# Altium schematic sheet 08-AD9513-1.SchDoc
size A; SheetNumber: 8; SheetTotal: 16
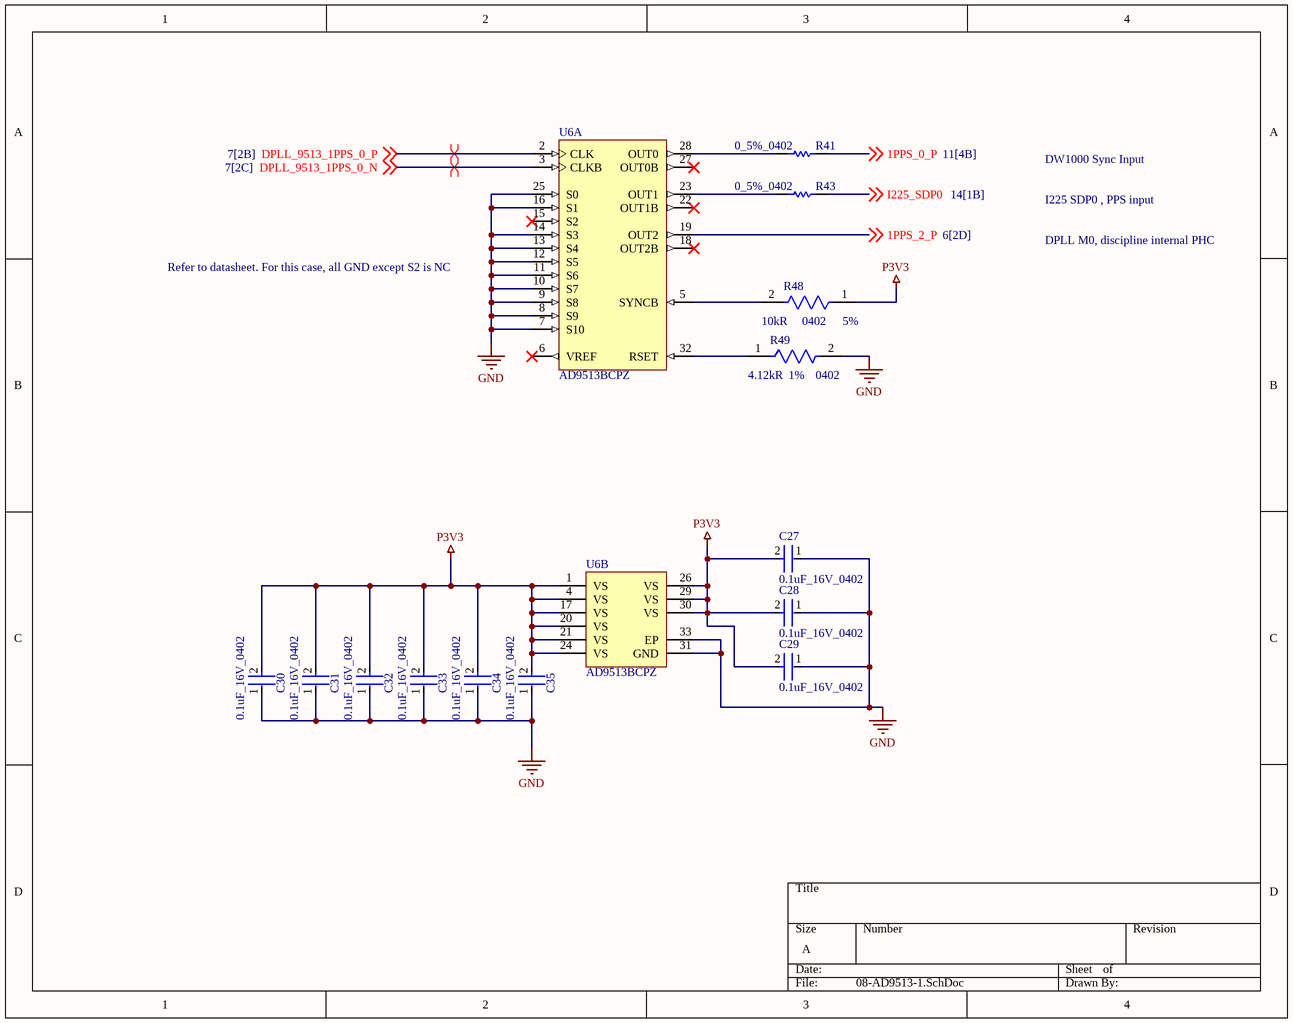
[diagram p0: 08-AD9513-1.SchDoc]

## Parts
C27  0.1uF_16V_0402  [FP-GRM15-MFG]
C28  0.1uF_16V_0402  [FP-GRM15-MFG]
C29  0.1uF_16V_0402  [FP-GRM15-MFG]
C30  0.1uF_16V_0402  [FP-GRM15-MFG]
C31  0.1uF_16V_0402  [FP-GRM15-MFG]
C32  0.1uF_16V_0402  [FP-GRM15-MFG]
C33  0.1uF_16V_0402  [FP-GRM15-MFG]
C34  0.1uF_16V_0402  [FP-GRM15-MFG]
C35  0.1uF_16V_0402  [FP-GRM15-MFG]
R41  0_5%_0402  [RESC1005X40X25LL10T10]
R43  0_5%_0402  [RESC1005X40X25LL10T10]
R48  Case/Package: 0402  Resistance: 10kR  Tolerance: 5%  [FP-CRCW0402-e3-IPC_B]  (hidden comment: CRCW040210K0JNED)
R49  Resistance: 4.12kR  Case/Package: 0402  Tolerance: 1%  [FP-CRCW0402-e3-IPC_A]  (hidden comment: CRCW04024K12FKED)
U6  AD9513BCPZ  [ADI-CP-32-2_N]  (parts A,B of 2)

## Nets
GND: C27.1 C28.1 C29.1 C30.1 C31.1 C32.1 C33.1 C34.1 C35.1 R49.2 U6.7(S10) U6.8(S9) U6.9(S8) U6.10(S7) U6.11(S6) U6.12(S5) U6.13(S4) U6.14(S3) U6.16(S1) U6.25(S0) U6.31(GND) U6.33(EP)
P3V3: C27.2 C28.2 C29.2 C30.2 C31.2 C32.2 C33.2 C34.2 C35.2 R48.1 U6.1(VS) U6.4(VS) U6.17(VS) U6.20(VS) U6.21(VS) U6.24(VS) U6.26(VS) U6.29(VS) U6.30(VS)
1PPS_0_P: R41.2 ; off-sheet 1PPS_0_P
1PPS_2_P: U6.19(OUT2) ; off-sheet 1PPS_2_P
DPLL_9513_1PPS_0_N: U6.3(CLKB) ; off-sheet DPLL_9513_1PPS_0_N
DPLL_9513_1PPS_0_P: U6.2(CLK) ; off-sheet DPLL_9513_1PPS_0_P
I225_SDP0: R43.2 ; off-sheet I225_SDP0
NetR41_1: R41.1 U6.28(OUT0)
NetR43_1: R43.1 U6.23(OUT1)
NetR48_2: R48.2 U6.5(SYNCB)
NetR49_1: R49.1 U6.32(RSET)

Not connected (* = marked no-connect by the designer): U6 6(VREF)* 15(S2)* 18(OUT2B)* 22(OUT1B)* 27(OUT0B)*

## Layout directives
differential pair; differential pair class 100ohm: DPLL_9513_1PPS_0_N, DPLL_9513_1PPS_0_P

## Notes on the sheet
- DW1000 Sync Input
- I225 SDP0 , PPS input
- (near U6) Refer to datasheet. For this case, all GND except S2 is NC
- DPLL M0, discipline internal PHC

## Library data of the parts
C27-C35 = CMP-2100-03641-2: CAP CER 0.1UF 16V X7R 0402; Manufacturer Part Number: GRM155R71C104KA88D; Manufacturer: Murata; Standoff Height: 0mm; Tolerance: 10%; Voltage Rating: 16Vdc; Material: Ceramic; Capacitance: 0.10μF; Value: 0.10μF; RoHS: TRUE; Temperature Characteristic: X7R; Octopart: https://octopart.com/grm155r71c104ka88d-murata-196880; Digikey Description: CAP CER 0.1UF 16V X7R 0402; Device Class L3: Ceramic Capacitors; Height: 0.55mm; ComponentLink2Description: Datasheet; Temperature Range Low: -55°C; Ipc Land Pattern Name: CAPC10050X219; ComponentLink2URL: https://search.murata.co.jp/Ceramy/image/img/A01X/G101/ENG/GRM155R71H471KA01-01A.pdf; Device Class L1: Passive Components; Lead Free: yes; Category: Cap; Package: GRM15; Temperature: -55°C to +125°C; Device Class L2: Capacitors; Temperature Range High: +125°C; Mouser Description: 0402 0.1 uF 16V ±10 % Tolerance X7R SMT Multilayer Ceramic Capacitor
R41 R43 = CMP-2002-04569-1: Manufacturer: KOA Speer; Part Number: RK73Z1ETTP
R48 = CMP-2002-08136-3: RES Thick Film, 10kΩ, 5%, 0.063W, 200ppm/°C, 0402; Voltage Rating: 50V; Power Rating: 63mW; Military Standard: Not; Packaging: Tape and Reel; Case Code (Imperial): 0402; Min Operating Temperature: -55°C; Case Code (Metric): 1005; Temperature Coefficient: 200ppm/°C; Termination: SMD/SMT; Composition: Thick Film; Depth: 0.5mm; Number of Terminations: 2; Contact Plating: Tin; Height: 0.016inch; Width: 0.5mm; Max Operating Temperature: 155°C; Features: Automotive AEC-Q200; Length: 1mm; Radiation Hardening: No; Max Power Dissipation: 63mW; Mount: Surface Mount; Package Quantity: 1; Weight: 2.3E-05oz
R49 = CMP-1011-00579-3: RES Thick Film, 4.12kΩ, 1%, 0.063W, 100ppm/°C, 0402; Power Rating: 63mW; Voltage Rating: 50V; Temperature Coefficient: 100ppm/°C; Max Operating Temperature: 155°C; Number of Terminations: 2; Number of Pins: 2; Radiation Hardening: No; Features: Automotive AEC-Q200; Height: 0.35mm; Length: 1mm; Lead Free: Lead Free; Military Standard: Not; Composition: Thick Film; Weight: 2.3E-05oz; Case Code (Metric): 1005; Case Code (Imperial): 0402; Max Power Dissipation: 63mW; Contact Plating: Tin; Min Operating Temperature: -55°C; Width: 0.02inch; Packaging: Tape and Reel; Depth: 0.5mm; Termination: SMD/SMT; Voltage Rating (DC): 50V; Package Quantity: 10
U6 = CMP-0288-00055-2: 3 Outputs, 800 MHz Clock Distribution IC with Dividers and Delay Adjust, 3.3 V Supply, Industrial, 32-pin QFN (CP-32-2), Tray; Manufacturer: Analog Devices; # of Outputs: 3; Max f-out: 800 MHz; On-Chip VCO or DCO: No; I/O Interface: Pin Select; Supply Voltage (V): 3.3; Output Logic: CMOS, LVDS; # of Inputs: 1; Packing: Tray; DatasheetVersion: Rev. 0; ComponentLink5Description: Reference Circuit; PartNumber: AD9513BCPZ; ComponentLink1Description: Manufacturer URL; ComponentLink2Description: Datasheet; ComponentLink1URL: http://www.analog.com/en/index.html; ComponentLink4URL: http://www.analog.com/en/clock-and-timing/clock-generation-and-distribution/ad9513/products/product.html; Code_JEDEC: MO-220-VHHD-2; ComponentLink3URL: http://www.analog.com/static/imported-files/packages/414143737956480539664569CP_32_2.pdf; PackageDescription: 32-Pin Lead Frame Chip Scale Package, Body 5 x 5 mm, Pitch 0.5 mm; PackageReference: CP-32-2; ComponentLink3Description: Package Specification; ComponentLink4Description: Product URL; Mounting Technology: Surface Mount; PackageVersion: 01/2005; ComponentLink2URL: http://www.analog.com/static/imported-files/data_sheets/AD9513.pdf; ComponentLink5URL: http://www.analog.com/en/clock-and-timing/clock-generation-and-distribution/ad9513/products/product.html#product-recommendations